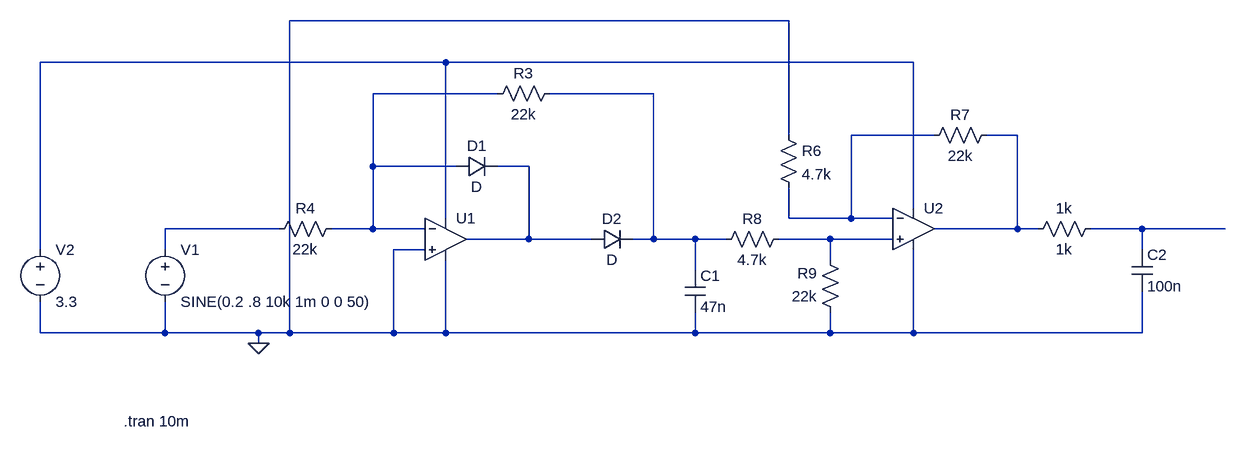
[diagram p0: schematic Envelope.asc]
Envelope.asc, the LTspice schematic file:
Version 4
SHEET 1 1972 680
WIRE 976 -240 208 -240
WIRE 448 -176 -176 -176
WIRE 1168 -176 448 -176
WIRE 528 -128 336 -128
WIRE 768 -128 608 -128
WIRE 976 -64 976 -240
WIRE 1200 -64 1072 -64
WIRE 1328 -64 1280 -64
WIRE 336 -16 336 -128
WIRE 464 -16 336 -16
WIRE 576 -16 528 -16
WIRE 1168 48 1168 -176
WIRE 448 64 448 -176
WIRE 976 64 976 16
WIRE 1072 64 1072 -64
WIRE 1072 64 976 64
WIRE 1136 64 1072 64
WIRE 192 80 16 80
WIRE 336 80 336 -16
WIRE 336 80 272 80
WIRE 416 80 336 80
WIRE 1328 80 1328 -64
WIRE 1328 80 1200 80
WIRE 1360 80 1328 80
WIRE 1520 80 1440 80
WIRE 1648 80 1520 80
WIRE 576 96 576 -16
WIRE 576 96 480 96
WIRE 672 96 576 96
WIRE 768 96 768 -128
WIRE 768 96 736 96
WIRE 832 96 768 96
WIRE 880 96 832 96
WIRE 1040 96 960 96
WIRE 1136 96 1040 96
WIRE -176 112 -176 -176
WIRE 16 112 16 80
WIRE 416 112 368 112
WIRE 1520 112 1520 80
WIRE 1040 128 1040 96
WIRE 832 144 832 96
WIRE -176 240 -176 192
WIRE 16 240 16 192
WIRE 16 240 -176 240
WIRE 160 240 16 240
WIRE 208 240 208 -240
WIRE 208 240 160 240
WIRE 368 240 368 112
WIRE 368 240 208 240
WIRE 448 240 448 128
WIRE 448 240 368 240
WIRE 832 240 832 208
WIRE 832 240 448 240
WIRE 1040 240 1040 208
WIRE 1040 240 832 240
WIRE 1168 240 1168 112
WIRE 1168 240 1040 240
WIRE 1520 240 1520 176
WIRE 1520 240 1168 240
WIRE 160 256 160 240
FLAG 160 256 0
SYMBOL voltage 16 96 R0
WINDOW 123 0 0 Left 2
WINDOW 39 0 0 Left 2
SYMATTR InstName V1
SYMATTR Value SINE(0.2 .8 10k 1m 0 0 50)
SYMBOL voltage -176 96 R0
WINDOW 123 0 0 Left 2
WINDOW 39 0 0 Left 2
SYMATTR InstName V2
SYMATTR Value 3.3
SYMBOL diode 672 112 R270
WINDOW 0 32 32 VTop 2
WINDOW 3 0 32 VBottom 2
SYMATTR InstName D2
SYMBOL Opamps\\UniversalOpamp2 448 96 R0
SYMATTR InstName U1
SYMBOL Opamps\\UniversalOpamp2 1168 80 R0
SYMATTR InstName U2
SYMBOL cap 816 144 R0
SYMATTR InstName C1
SYMATTR Value 47n
SYMBOL res 960 -80 R0
SYMATTR InstName R6
SYMATTR Value 4.7k
SYMBOL res 1296 -80 R90
WINDOW 0 0 56 VBottom 2
WINDOW 3 32 56 VTop 2
SYMATTR InstName R7
SYMATTR Value 22k
SYMBOL res 976 80 R90
WINDOW 0 0 56 VBottom 2
WINDOW 3 32 56 VTop 2
SYMATTR InstName R8
SYMATTR Value 4.7k
SYMBOL res 1056 224 R180
WINDOW 0 36 76 Left 2
WINDOW 3 36 40 Left 2
SYMATTR InstName R9
SYMATTR Value 22k
SYMBOL res 1456 64 R90
WINDOW 0 0 56 VBottom 2
WINDOW 3 32 56 VTop 2
SYMATTR InstName 1k
SYMATTR Value 1k
SYMBOL cap 1504 112 R0
SYMATTR InstName C2
SYMATTR Value 100n
SYMBOL diode 464 0 R270
WINDOW 0 32 32 VTop 2
WINDOW 3 0 32 VBottom 2
SYMATTR InstName D1
SYMBOL res 512 -112 R270
WINDOW 0 32 56 VTop 2
WINDOW 3 0 56 VBottom 2
SYMATTR InstName R3
SYMATTR Value 22k
SYMBOL res 288 64 R90
WINDOW 0 0 56 VBottom 2
WINDOW 3 32 56 VTop 2
SYMATTR InstName R4
SYMATTR Value 22k
TEXT -48 376 Left 2 !.tran 10m

The netlist it stands for:
* Envelope.asc
V1 N007 0 SINE(0.2 .8 10k 1m 0 0 50)
V2 N001 0 3.3
D2 N006 N003 D
XU1 0 N002 N001 0 N006 level.2 Avol=1Meg GBW=10Meg Slew=10Meg ilimit=25m rail=0 Vos=0 phimargin=45 en=0 enk=0 in=0 ink=0 Rin=500Meg  ; pins IN+ IN- V+ V- OUT
XU2 N009 N004 N001 0 N005 level.2 Avol=1Meg GBW=10Meg Slew=10Meg ilimit=25m rail=0 Vos=0 phimargin=45 en=0 enk=0 in=0 ink=0 Rin=500Meg  ; pins IN+ IN- V+ V- OUT
C1 N003 0 47n
R6 0 N004 4.7k
R7 N005 N004 22k
R8 N009 N003 4.7k
R9 0 N009 22k
R§1k N008 N005 1k
C2 N008 0 100n
D1 N002 N006 D
R3 N002 N003 22k
R4 N002 N007 22k
.model D D
.lib standard.dio
.tran 10m
.lib UniversalOpamps2.sub
.backanno
.end